# EAGLE design YOTSUBA_GNSS-receiver_ver.1.1 (EAGLE 9.6.2)
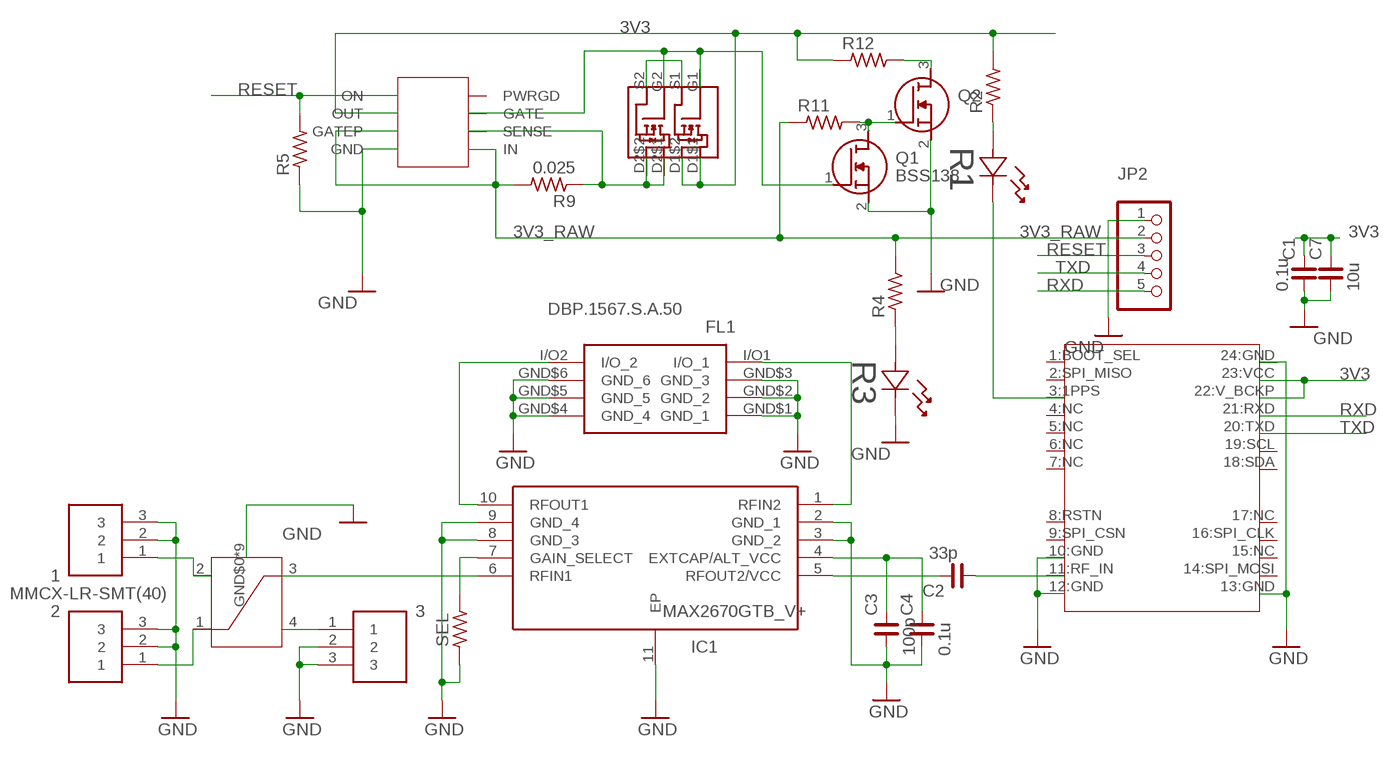
[diagram p0: schematic, sheet 1]

## Parts
1  MMCX-LR-SMT(40)  [MMCX-LR-SMT(40)]
2  MMCX-LR-SMT(40)  [MMCX-LR-SMT(40)]
3  MMCX-LR-SMT(40)  [MMCX-LR-SMT(40)]
C1  0.1u  C_0603  [C0603]
C2  33p  C_0603  [C0603]
C3  100p  C_0603  [C0603]
C4  0.1u  C_0603  [C0603]
C7  10u  C_0603  [C0603]
FL1  DBP.1567.S.A.50  [DBP1567SA50]
IC1  MAX2670GTB_V+  [SON50P300X300X80-11N]
JP2  PINHD-1X5  [1X05]
Q1  BSS138  [SOT95P240X120-3N]
Q2  BSS138  [SOT95P240X120-3N]
R1  SML-E12P8WT86  [LED_SMLD12_ROM]
R2  R_0603  [R0603]
R3  SML-E12P8WT86  [LED_SMLD12_ROM]
R4  R_0603  [R0603]
R5  R_0603  [R0603]
R9  0.025  R_0603  [R0603]
R11  R_0603  [R0603]
R12  R_0603  [R0603]
SEL  R_0603  [R0603]
U$1  ORION_B16  [ORION_B16]
U$3  HC125.A  [HC125.A]
U$7  DMG6898LSD  [SOIC127P600X150-8N]
U$8  LTC4361  [SOP65P280X100-8N]

## Nets
3V3 [POWER]: C1.2 C7.2 R2.2 R12.1 U$1.22:V_BCKP U$1.23:VCC U$7.D1$1 U$7.D1$2 U$8.OUT
3V3_RAW [POWER]: JP2.2 R4.2 R9.2 R11.1 U$8.GATEP U$8.IN
GND [gnd]: 1.2 1.3 2.2 2.3 3.2 3.3 C1.1 C3.1 C4.1 C7.1 FL1.GND$1(GND_1) FL1.GND$2(GND_2) FL1.GND$3(GND_3) FL1.GND$4(GND_4) FL1.GND$5(GND_5) FL1.GND$6(GND_6) IC1.2(GND_1) IC1.3(GND_2) IC1.8(GND_3) IC1.9(GND_4) IC1.11(EP) JP2.1 Q1.2(S) Q2.2(S) R3.1 R5.1 SEL.1 U$1.10:GND U$1.12:GND U$1.13:GND U$1.24:GND U$3.GND$0(GND) U$3.GND$1(GND) U$3.GND$2(GND) U$3.GND$3(GND) U$3.GND$4(GND) U$3.GND$5(GND) U$3.GND$6(GND) U$3.GND$7(GND) U$3.GND$8(GND) U$8.GND
N$1: 1.1 U$3.2
N$2: 2.1 U$3.1
N$3 [50Ω]: IC1.6(RFIN1) U$3.3
N$4: R1.1 U$1.3:1PPS
N$5: R1.2 R2.1
N$6: 3.1 U$3.4
N$7: IC1.7(GAIN_SELECT) SEL.2
N$8 [50Ω]: FL1.I/O2(I/O_2) IC1.10(RFOUT1)
N$9 [50Ω]: FL1.I/O1(I/O_1) IC1.1(RFIN2)
N$10: C3.2 C4.2 IC1.4(EXTCAP/ALT_VCC)
N$11 [50Ω]: C2.2 IC1.5(RFOUT2/VCC)
N$12 [50Ω]: C2.1 U$1.11:RF_IN
N$13: R3.2 R4.1
N$19: U$7.S1 U$7.S2
N$20: R9.1 U$7.D2$1 U$7.D2$2 U$8.SENSE
N$22: Q1.1(G) U$7.G1 U$7.G2 U$8.GATE
N$24: Q1.3(D) Q2.1(G) R11.2
N$26: Q2.3(D) R12.2
RESET [gnd]: JP2.3 R5.2 U$8.ON
RXD: JP2.5 U$1.21:RXD
TXD: JP2.4 U$1.20:TXD
Unconnected: U$1.1:BOOT_SEL U$1.2:SPI_MISO U$1.4:NC U$1.5:NC U$1.6:NC U$1.7:NC U$1.8:RSTN U$1.9:SPI_CSN U$1.14:SPI_MOSI U$1.15:NC U$1.16:SPI_CLK U$1.17:NC U$1.18:SDA U$1.19:SCL U$8.PWRGD

## Library data of the parts
1-3 = MMCX-LR-SMT(40):MMCX-LR-SMT(40)
C1-C4 C7 = rc-master_custom:C_: NON-POLARIZED CAP
FL1 = DBP.1567.S.A.50:DBP.1567.S.A.50: Ceramic Filters Band Pass 1567.5MHz 1dB 50Ohm SMD 2Pin Source: Datasheet <https://www.taoglas.com/datasheets/DBP.1567.S.A.50.pdf>; DESCRIPTION: Ceramic Filters Band Pass 1567.5MHz 1dB 50Ohm SMD 2Pin; HEIGHT: 4.2mm; MANUFACTURER_NAME: Taoglas; MANUFACTURER_PART_NUMBER: DBP.1567.S.A.50
IC1 = MAX2670GTB_V+:MAX2670GTB_V+: RF Amplifier GPS/GNSS Front End Amplifier Source: Datasheet <https://componentsearchengine.com/Datasheets/1/MAX2670GTB_V .pdf>; DESCRIPTION: RF Amplifier GPS/GNSS Front End Amplifier; HEIGHT: 0.8mm; MANUFACTURER_NAME: Analog Devices; MANUFACTURER_PART_NUMBER: MAX2670GTB/V+; MOUSER_PART_NUMBER: 700-MAX2670GTB/V+; MOUSER_PRICE-STOCK: https://www.mouser.com/Search/Refine.aspx?Keyword=700-MAX2670GTB%2FV%2B
JP2 = pinhead:PINHD-1X5: PIN HEADER
Q1 Q2 = BSS138:BSS138: N-channel MOSFET,BSS138 0.2A 50V Source: Datasheet <https://www.onsemi.com/pub/Collateral/BSS138-D.PDF>; ARROW_PART_NUMBER: BSS138; ARROW_PRICE-STOCK: https://www.arrow.com/en/products/bss138/on-semiconductor; DESCRIPTION: N-channel MOSFET,BSS138 0.2A 50V; HEIGHT: 1.2mm; MANUFACTURER_NAME: onsemi; MANUFACTURER_PART_NUMBER: BSS138; MOUSER_PART_NUMBER: 512-BSS138; MOUSER_PRICE-STOCK: https://www.mouser.co.uk/ProductDetail/onsemi-Fairchild/BSS138?qs=HK%252BeIG1iaahCeqBvjB4arg%3D%3D
R1 R3 = LED_1608_2:SML-E12P8WT86; COPYRIGHT: Copyright (C) 2023 Ultra Librarian. All rights reserved.; DIGI-KEY_PART_NUMBER_1: 511-1585-1-ND; DIGI-KEY_PART_NUMBER_2: 511-1585-2-ND; DIGI-KEY_PART_NUMBER_3: 511-1585-6-ND; MANUFACTURER_PART_NUMBER: SML-E12P8WT86; MFR_NAME: ROHM Semiconductor
R2 R4 R5 R9 R11 R12 SEL = rc-master_custom:R_: RESISTOR
U$1 = Orion_B16:ORION_B16
U$3 = HC125.A:HC125.A
U$7 = DMG6898LSD:DMG6898LSD
U$8 = ltc4361:LTC4361

## Net classes
0 default: clearance 0.121 mm
2 gnd: clearance 0.212 mm to class 1, clearance 0.254 mm
3 POWER: width 0.305 mm, clearance 0.025 mm

## Board
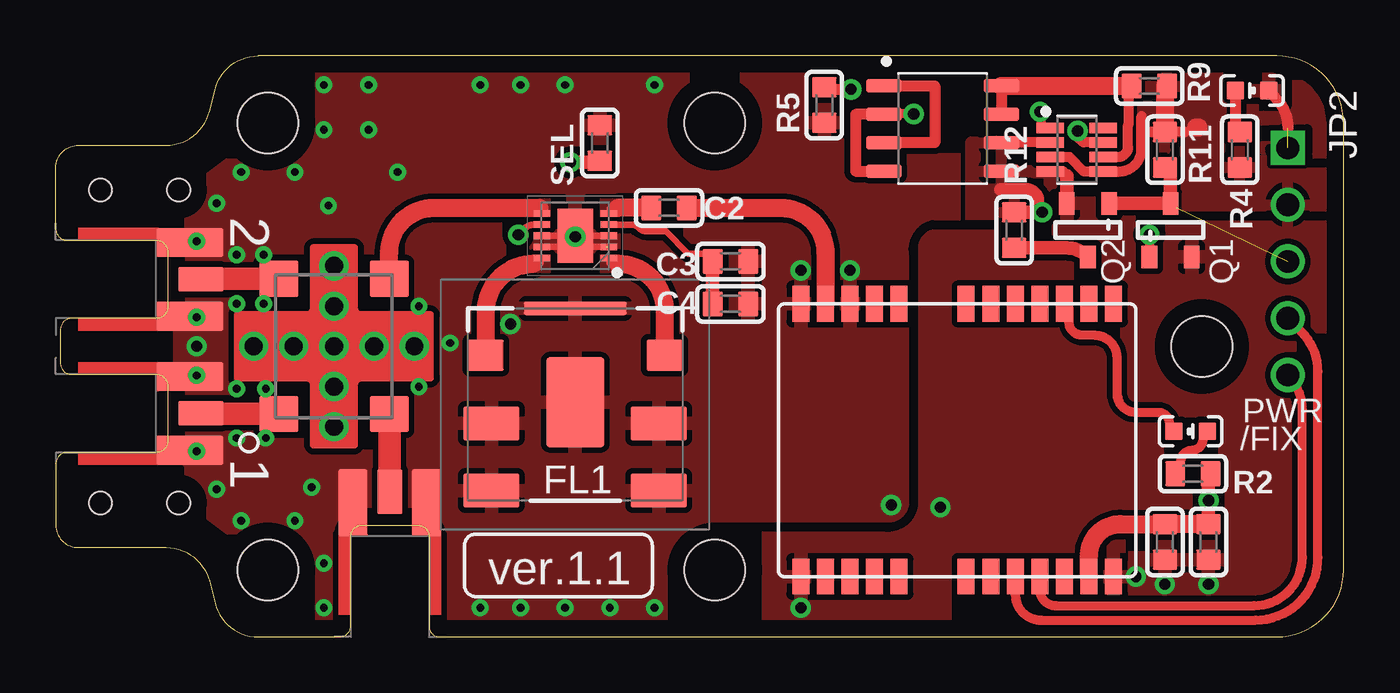
[diagram p1: board, top side]
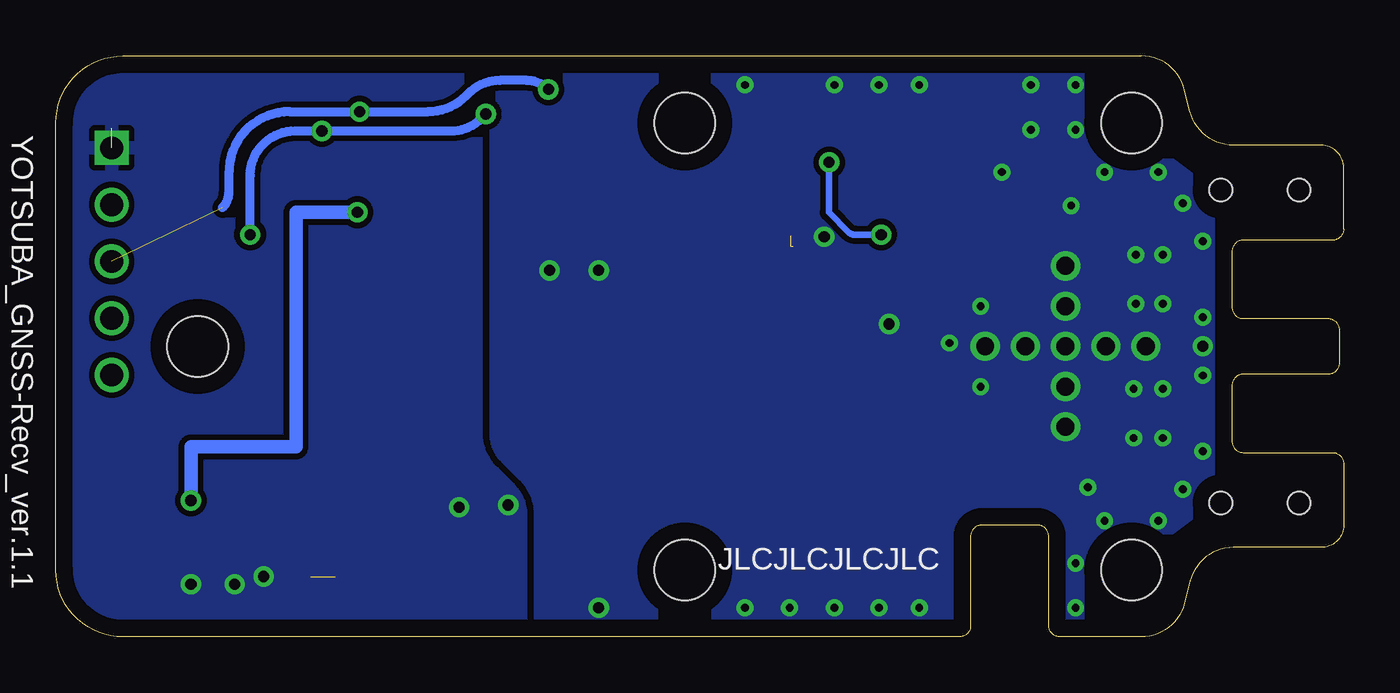
[diagram p2: board, bottom side, seen from below]

Size 57.65 x 26 mm. Coordinates in mm from the lower left corner, seen from the top.
Outline: 1,4 4.94,4 arc-76 6.88,2.48 7.12,1.51 arc76 9.06,0 12.7,0 arc90 13.2,0.5 13.2,4.5 arc-90 13.7,5 16.2,5 arc-90 16.7,4.5 16.7,0.5 arc90 17.2,0 54.65,0 arc90 57.65,3 57.65,23 arc90 54.65,26 9.06,26 arc76 7.12,24.48 6.88,23.52 arc-76 4.94,22 1,22 arc90 0,21 0,18.25 arc90 0.5,17.75 4.5,17.75 arc-90 5,17.25 5,14.75 arc-90 4.5,14.25 0.7,14.25 arc90 0.2,13.75 0.2,12.25 arc90 0.7,11.75 4.5,11.75 arc-90 5,11.25 5,8.75 arc-90 4.5,8.25 0.5,8.25 arc90 0,7.75 0,5 arc90 1,4
Copper layers (1*16): Top 0.035mm / dielectric 1.2mm / Bottom 0.035mm
Design rules "default *": minimum track width 6mil, minimum drill 0.35mm, track to track 6mil, track to pad 6mil, pad to pad 6mil, via to via 6mil, smd to smd 6mil, copper to edge 30mil, drill to drill 6mil, minimum pad ring 10mil, minimum via ring 8mil, stop-mask expansion 2mil, vias tented up to drill 30mil, thermal gap 10mil
Holes 1 mm at 2,6 5.5,6 2,20 5.5,20
Holes 2.7 mm at 9.5,3 9.5,23 29.5,23 29.5,3 51.3,13
tRestrict: 39 lines
bRestrict: 12 lines

### Footprints (pad centres in the part's own frame; a part is rotated, then mirrored left to right if it is on the bottom)
MMCX-LR-SMT(40) = smd 1.1 x 2: 1 0,-2 | smd 1.3 x 3: 2 1.65,-1.5; 3 -1.65,-1.5
C0603 = smd 0.9 x 1.1: 1 -0.794,0; 2 0.794,0
DBP1567SA50 = smd 2.5 x 1.5: GND$1 1.05,6.75; GND$2 1.05,3.75; GND$4 8.55,3.75; GND$5 8.55,6.75 | smd 2.6 x 4: GND$3 4.8,2.8 | smd 4.6 x 0.6: GND$6 4.8,-1.4 | smd 1.6 x 1.4: I/O1 0.8,0.7; I/O2 8.8,0.7
SON50P300X300X80-11N = smd 0.75 x 0.3: 1 -1.5,1; 2 -1.5,0.5; 3 -1.5,0; 4 -1.5,-0.5; 5 -1.5,-1; 6 1.5,-1; 7 1.5,-0.5; 8 1.5,0; 9 1.5,0.5; 10 1.5,1 | smd 1.6 x 2.4: 11 0,0
1X05 = drill 1.016 square: 1 -5.08,0 | drill 1.016: 2 -2.54,0; 3 0,0; 4 2.54,0; 5 5.08,0
SOT95P240X120-3N = smd 1 x 0.7: 1 -1.2,0.95; 2 -1.2,-0.95; 3 1.2,0
LED_SMLD12_ROM = smd 0.8 x 0.8: 1 -0.75,0; 2 0.75,0
R0603 = smd 0.9 x 1.1: 1 -0.794,0; 2 0.794,0
ORION_B16 = smd 1.6 x 0.8: 1:BOOT_SEL 12.2,1; 2:SPI_MISO 12.2,2.1; 3:1PPS 12.2,3.2; 4:NC 12.2,4.3; 5:NC 12.2,5.4; 6:NC 12.2,6.5; 7:NC 12.2,7.6; 8:RSTN 12.2,10.6; 9:SPI_CSN 12.2,11.7; 10:GND 12.2,12.8; 11:RF_IN 12.2,13.9; 12:GND 12.2,15; 13:GND 0,15; 14:SPI_MOSI 0,13.9; 15:NC 0,12.8; 16:SPI_CLK 0,11.7; 17:NC 0,10.6; 18:SDA 0,7.6; 19:SCL 0,6.5; 20:TXD 0,5.4; 21:RXD 0,4.3; 22:V_BCKP 0,3.2; 23:VCC 0,2.1; 24:GND 0,1
HC125.A = smd 1.625 x 1.75: 1 -3.022,2.475; 2 3.022,2.475; 3 3.022,-2.475; 4 -3.022,-2.475 | drill 0.8: GND$0 0,0; GND$1 0,3.6; GND$2 0,1.8; GND$3 0,-3.6; GND$4 0,-1.8; GND$5 -3.6,0; GND$6 -1.8,0; GND$7 3.6,0; GND$8 1.8,0
SOIC127P600X150-8N = smd 1.58 x 0.589: D1$1 -2.625,1.905; D1$2 -2.625,0.635; D2$1 -2.625,-0.635; D2$2 -2.625,-1.905; G1 2.625,1.905; G2 2.625,-0.635; S1 2.625,0.635; S2 2.625,-1.905
SOP65P280X100-8N = smd 1.237 x 0.459: GATE 1.187,0.325; GATEP -1.187,-0.325; GND -1.187,-0.975; IN 1.187,-0.975; ON -1.187,0.975; OUT -1.187,0.325; PWRGD 1.187,0.975; SENSE 1.187,-0.325

### Placement (x,y rotation side)
1  4.5,16 90 top
2  4.5,10 90 top
3  14.95,4.5 180 top
C1  49.65,4.25 90 top
C2  27.45,19.2 180 top
C3  30.2,16.8 180 top
C4  30.2,14.9 180 top
C7  51.6,4.25 90 top
FL1  28.05,13.3 180 top
IC1  23.25,17.95 180 top
JP2  55.15,16.8 270 top
Q1  49.9,18.2 90 top
Q2  46.2,18.2 270 top
R1  50.8,9.2 0 top
R2  50.9,7.3 0 top
R3  53.55,24.45 180 top
R4  53,21.8 270 top
R5  34.4,23.8 90 top
R9  48.95,24.65 0 top
R11  49.65,21.8 270 top
R12  42.9,18.2 270 top
SEL  24.35,22.1 270 top
U$1  48.35,2.7 90 top
U$3  12.45,13 90 top
U$7  39.7,22.75 180 top
U$8  45.7,21.8 0 top

### Tracks (layer width: path | path; a pad name or v marks a point on that pad's centre or on a via)
3V3  (via drill 0.5)  (1 unrouted)
  Top 0.4: U$7.D1$2 42.33,22.14
  Top 0.45: U$7.D1$2 42.34,22.12 U$8.OUT
  Top 0.5: C7.2 51.75,5.19
  Top 0.6: C7.2 v51.6,6.1 51.6,7.21 R2.2 | R12.1 v44.15,19 43.95,19.2 43.95,19.5 arc90 43.45,20 42.3,20
  Top 0.8: U$1.23:VCC 46.25,3.64 arc-90 47.65,5.04 C1.2 C7.2
  Bottom 0.6: v51.6,6.1 51.6,8.5 46.9,8.5 46.9,19 v44.15,19
  pour Top: 39.85,18.9 39.85,21.5 40.55,22.2 43.15,22.2 43.15,18.9
3V3_RAW
  Top 0.45: R11.1 48.6,22.59 48.6,21.82 arc-90 47.6,20.82 U$8.IN 46.02,20.82 45.38,21.48 U$8.GATEP | 51.15,22.8 51.15,22.89 | 50.55,22.59 R11.1 | R11.1 48.6,22.59 48.6,23.3
  Top 0.8: R9.2 49.65,24.65 R11.1 | 51.05,22.8 51.15,22.8
  pour Top: 45.8,24.2 45.8,26.2 58.05,26.2 58.05,18.1 50,18.1 50,21.9 48,21.9 48,24.2
GND  (via drill 0.35, 0.5)  (3 unrouted)
  Top 0.2: U$8.GND 44.32,20.82 | Q2.2 45.25,19.7
  Top 0.3: 24.65,17.45 IC1.9 | IC1.3 IC1.11 IC1.8 | C4.1
  Top 0.4: U$8.GND 45.06,20.82
  Top 0.5: 45.25,20.64 45.06,20.82 | R3.1 54.69,24.01 arc-45 55.15,22.77
  Top 0.6: 45.25,19.7 45.25,20.64
  other vias: 26.8,1.3 24.8,1.3 22.8,1.3 20.8,1.3 26.8,24.7 22.8,24.7 20.8,24.7 19,24.7 19,1.3 14,24.7 12,24.7 12,1.3 12,3.3 14,22.7 12,22.7 15.3,20.8 10.7,20.8 8.3,20.8 10.7,5.2 8.3,5.2 6.3,14.3 6.3,11.7 6.3,17.7 6.3,8.3 6.3,13 7.2,19.4 7.2,6.6 16.25,14.8 16.25,11.2 9.4,11.1 9.3,14.9 9.4,8.9 9.3,17.1 8.1,17.1 8.1,14.9 8.1,11.1 8.1,8.9 11.45,6.7 12.2,19.3 17.65,13.15 49.65,2.35 51.6,2.35 37.4,5.9 23.25,17.9 39.6,5.8 33.35,1.3 48.35,2.7 35.55,16.4 33.35,16.4 20.35,14
  pour Top: -2.8,28.55 60.85,28.55 arc-90 61.85,27.55 61.85,-2.25 -2.8,-2.25
  pour Bottom: -1.75,27.55 60.8,27.55 60.8,-1.3 -1.75,-1.3
N$1
  Top 1: U$3.2 6.5,16.02 1.1
N$2
  Top 1: U$3.1 6.2,9.98 6.22,10 2.1
  Top 1.1: U$3.1 10.25,9.98
N$3
  Top 0.3: IC1.6 21.65,19.05 21.64,19.2
  Top 0.8: 14.72,16.22 U$3.3 14.93,17.2 arc-90 16.93,19.2 21.64,19.2
  pour Top: 22.15,18.8 22.15,19.6 21.6,19.6 21.6,18.8
N$4
  Top 0.4: U$1.3:1PPS 45.35,14.7 45.35,14.1 arc90 45.95,13.5 46.5,13.5 arc-90 47.5,12.5 47.5,10.9 arc90 48.35,10.05 49.35,10.05 arc-90 49.85,9.55 49.85,9.4 R1.1
N$5
  Top 0.4: R2.1 50.36,7.55 50.36,7.85 arc-90 50.86,8.35 arc90 51.35,8.84 51.35,9 R1.2
N$6
  Top 1: U$3.4 14.95,10 3.1
N$7  (via drill 0.5)
  Top 0.3: IC1.7 21.42,18.45 arc45 20.96,18.26 v20.7,18
  Top 0.6: SEL.2 24.28,21.24 v23.04,21.24
  Bottom 0.3: v20.7,18 21.89,18 arc45 22.16,18.11 23.05,19 23.05,21.22 v23.04,21.24
N$8
  Top 0.2: 21.4,16.7 21.75,16.7 IC1.10
  Top 0.8: FL1.I/O2 19.25,14.55 arc-90 21.4,16.7
  pour Top: 22.15,17.1 22.15,16.3 21.35,16.3 21.35,17.1
N$9
  Top 0.2: 25.15,16.7 24.75,16.7 IC1.1
  Top 0.3: 26.95,12.9 FL1.I/O1
  Top 0.8: 25.15,16.7 arc-90 27.25,14.6 FL1.I/O1
  pour Top: 25.15,16.3 24.35,16.3 24.35,17.1 25.15,17.1
N$10
  Top 0.3: C3.2 29.06,17.15 28.31,17.15 27.31,18.15 26.47,18.15 arc-45 26.1,18.3 26.05,18.35 arc45 25.81,18.45 IC1.4
  Top 0.6: C3.2 C4.2
N$11
  Top 0.152: 25.15,19.2 24.75,19.2 IC1.5
  Top 0.8: C2.2 25.15,19.2
  pour Top: 24.35,19.6 25.15,19.6 25.15,18.8 24.35,18.8
N$12
  Top 0.8: C2.1 32.45,19.2 arc-90 34.45,17.2 U$1.11:RF_IN
N$13
  Top 0.5: R3.2 52.8,22.79 R4.1
N$19
  Top 0.5: 36.85,24.66 U$7.S2 39.35,24.66 39.35,22.11 U$7.S1
N$20
  Top 0.45: U$8.SENSE 47.55,21.48 arc90 48,21.93 48,22.89 48.01,22.9 48.01,24.5 R9.1
  Top 0.5: 47.95,24.86 R9.1 | U$7.D2$2 U$7.D2$1
  Top 0.6: R9.1
  Top 0.8: U$7.D2$2 R9.1
N$22  (via drill 0.5)
  Top 0.4: v48.95,18 Q1.1 | v38.4,23.4 37.41,23.4 37.4,23.39
  Top 0.45: U$8.GATE 46,22.12 45.74,22.39 v45.74,22.64
  Top 0.5: 37.4,23.39 U$7.G2 35.8,23.39 35.8,20.84 U$7.G1
  Bottom 0.4: v48.95,18 48.95,20.64 arc90 46.95,22.64 v45.74,22.64 39.97,22.64 arc-48 38.48,23.31 v38.4,23.4
N$24
  Top 0.6: R11.2 49.9,20.76 Q1.3 Q2.1
N$26
  Top 0.6: R12.2 45.27,17.41 arc-45 46.17,17.03 Q2.3
RESET  (via drill 0.5)  (1 unrouted)
  Top 0.4: v44.05,23.5 44.1,23.45 44.1,22.77 U$8.ON
  Top 0.5: R5.2 34.44,24.5 v35.6,24.5
  Bottom 0.4: v35.6,24.5 arc-45 36.57,24.9 37.77,24.9 arc-45 39.19,24.31 39.31,24.19 arc45 40.97,23.5 v44.05,23.5 47.2,23.5 arc-90 49.9,20.8 49.9,19.91 arc45 50.19,19.21
RXD
  Top 0.4: U$1.21:RXD 44.05,2.1 arc90 44.75,1.4 53.65,1.4 arc90 55.8,3.55 55.8,10.15 arc45 JP2.5
TXD
  Top 0.4: U$1.20:TXD 42.95,1.9 arc90 44.1,0.75 53.7,0.75 arc90 56.5,3.55 56.5,11.87 arc45 55.77,13.64 JP2.4

### Text on the board
tNames: 2 | PWR | 1 | /FIX | ver.1.1
bNames: YOTSUBA_GNSS-Recv_ver.1.1 | JLCJLCJLCJLC